# Altium project ALT0033 - Carnaval kleding REV E.PrjPcb
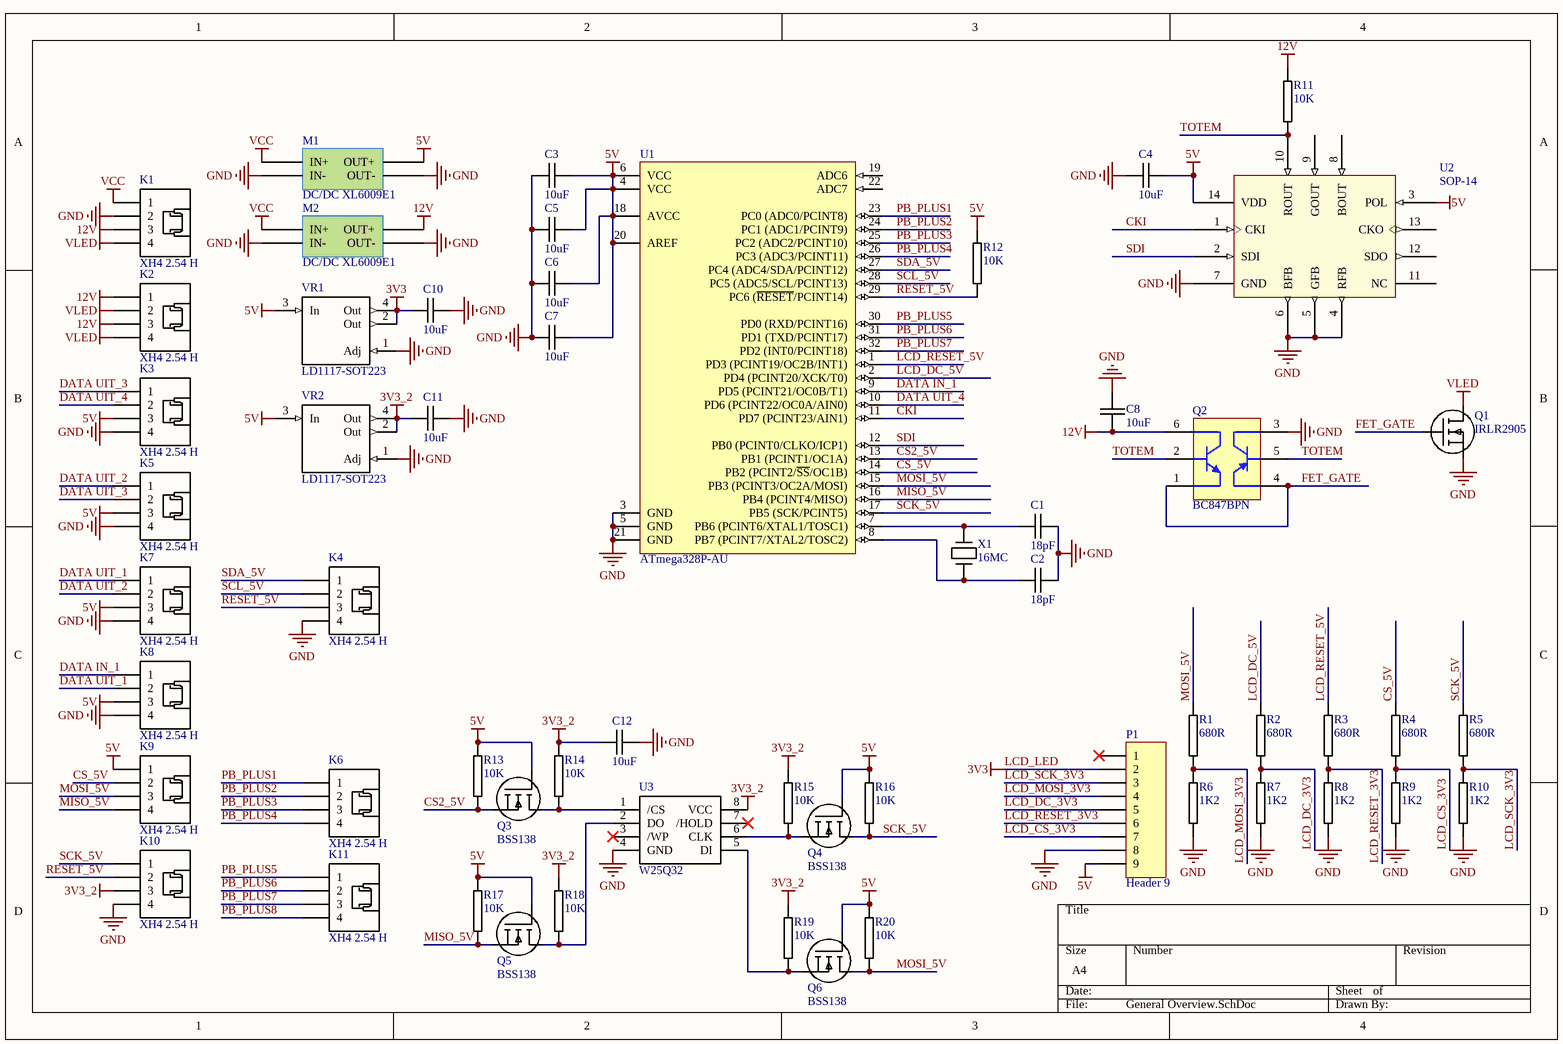
[diagram p0: General Overview.SchDoc]
1 sheet, 57 parts. Net scope: global (net labels, ports and power ports of the same name join across sheets).
Board file: A0033 - Carnaval kleding REV E - PCB.PcbDoc

## Sheet General Overview.SchDoc
size A4; PageSetup: Record=PageOptions|CenterHorizontal=True|CenterVertical=True|PrintScale=1.00|XCorrection=1.00|YCorrection=1.00|PrintKind=0|BorderSize=5000000|LeftOffset=0|BottomOffset=0|Orientation=2|PaperLength=1000|PaperWidth=1000|Scale=100|PaperSource=7|PrintQuality=-4|MediaType=1|DitherType=10|PaperKind=A4|PrintScaleMode=0

### Parts
C1  18pF  [0603C-GENERIC]
C2  18pF  [0603C-GENERIC]
C3  10uF  [0805C-GENERIC]
C4  10uF  [0805C-GENERIC]
C5  10uF  [0805C-GENERIC]
C6  10uF  [0805C-GENERIC]
C7  10uF  [0805C-GENERIC]
C8  10uF  [0805C-GENERIC]
C10  10uF  [0805C-GENERIC]
C11  10uF  [0805C-GENERIC]
C12  10uF  [0805C-GENERIC]
K1  XH4 2.54 H  [XH4 2.54 H]
K2  XH4 2.54 H  [XH4 2.54 H]
K3  XH4 2.54 H  [XH4 2.54 H]
K4  XH4 2.54 H  [XH4 2.54 H]
K5  XH4 2.54 H  [XH4 2.54 H]
K6  XH4 2.54 H  [XH4 2.54 H]
K7  XH4 2.54 H  [XH4 2.54 H]
K8  XH4 2.54 H  [XH4 2.54 H]
K9  XH4 2.54 H  [XH4 2.54 H]
K10  XH4 2.54 H  [XH4 2.54 H]
K11  XH4 2.54 H  [XH4 2.54 H]
M1  DC/DC XL6009E1  [DCDC XL6009E1]
M2  DC/DC XL6009E1  [DCDC XL6009E1]
P1  Header 9  [HDR1X9]
Q1  IRLR2905  [TO252AA-GDS]
Q2  BC847BPN  [SOT363_N]
Q3  BSS138  [SOT23-GDS]
Q4  BSS138  [SOT23-GDS]
Q5  BSS138  [SOT23-GDS]
Q6  BSS138  [SOT23-GDS]
R1  680R  [0805R-680]
R2  680R  [0805R-680]
R3  680R  [0805R-680]
R4  680R  [0805R-680]
R5  680R  [0805R-680]
R6  1K2  [0805R-1K2]
R7  1K2  [0805R-1K2]
R8  1K2  [0805R-1K2]
R9  1K2  [0805R-1K2]
R10  1K2  [0805R-1K2]
R11  10K  [0805R-10K]
R12  10K  [0805R-10K]
R13  10K  [0805R-10K]
R14  10K  [0805R-10K]
R15  10K  [0805R-10K]
R16  10K  [0805R-10K]
R17  10K  [0805R-10K]
R18  10K  [0805R-10K]
R19  10K  [0805R-10K]
R20  10K  [0805R-10K]
U1  ATmega328P-AU  [32A_N]
U2  SOP-14  [SO14]
U3  W25Q32  [SO8]
VR1  LD1117-SOT223  [SOT223]
VR2  LD1117-SOT223  [SOT223]
X1  16MC  [HC49_US TH]

### Nets
3V3_2: C11.2 C12.2 K10.3 R14.1 R15.1 R18.1 R19.1 U3.8(VCC) VR2.2(Out) VR2.4(Out)
5V: C3.1 C4.1 C5.2 C6.2 C7.2 K3.3 K5.3 K7.3 K8.3 K9.1 M1.OUT+ P1.9 Q3.G Q4.G Q5.G Q6.G R12.1 R13.1 R16.1 R17.1 R20.1 U1.4(VCC) U1.6(VCC) U1.18(AVCC) U1.20(AREF) U2.3(POL) U2.14(VDD) VR1.3(In) VR2.3(In)
12V: C8.2 K1.3 K2.1 K2.3 M2.OUT+ Q2.6(C1) R11.1
GND: C1.2 C2.2 C3.2 C4.2 C5.1 C6.1 C7.1 C8.1 C10.1 C11.1 C12.1 K1.2 K3.4 K4.4 K5.4 K7.4 K8.4 K10.4 M1.IN- M1.OUT- M2.IN- M2.OUT- P1.8 Q1.S Q2.3(C2) R6.2 R7.2 R8.2 R9.2 R10.2 U1.3(GND) U1.5(GND) U1.21(GND) U2.4(RFB) U2.5(GFB) U2.6(BFB) U2.7(GND) U3.4(GND) VR1.1(Adj) VR2.1(Adj)
LCD_LED: C10.2 P1.2 VR1.2(Out) VR1.4(Out)  [also labelled 3V3]
VCC: K1.1 M1.IN+ M2.IN+
VLED: K1.4 K2.2 K2.4 Q1.D
CKI: U1.11(PD7_(PCINT23/AIN1)) U2.1(CKI)
CS2_5V: Q3.S R13.2 U1.13(PB1_(PCINT1/OC1A))
CS_5V: K9.2 R4.1 U1.14(PB2_(PCINT2/~{SS}/OC1B))
DATA IN_1: K8.1 U1.9(PD5_(PCINT21/OC0B/T1))
DATA UIT_1: K7.1 K8.2
DATA UIT_2: K5.1 K7.2
DATA UIT_3: K3.1 K5.2
DATA UIT_4: K3.2 U1.10(PD6_(PCINT22/OC0A/AIN0))
FET_GATE: Q1.G Q2.1(E1) Q2.4(E2)
LCD_CS_3V3: P1.7 R4.2 R9.1
LCD_DC_3V3: P1.5 R2.2 R7.1
LCD_DC_5V: R2.1 U1.2(PD4_(PCINT20/XCK/T0))
LCD_MOSI_3V3: P1.4 R1.2 R6.1
LCD_RESET_3V3: P1.6 R3.2 R8.1
LCD_RESET_5V: R3.1 U1.1(PD3_(PCINT19/OC2B/INT1))
LCD_SCK_3V3: P1.3 R5.2 R10.1
MISO_5V: K9.4 Q5.S R17.2 U1.16(PB4_(PCINT4/MISO))
MOSI_5V: K9.3 Q6.D R1.1 R20.2 U1.15(PB3_(PCINT3/OC2A/MOSI))
PB_PLUS1: K6.1 U1.23(PC0_(ADC0/PCINT8))
PB_PLUS2: K6.2 U1.24(PC1_(ADC1/PCINT9))
PB_PLUS3: K6.3 U1.25(PC2_(ADC2/PCINT10))
PB_PLUS4: K6.4 U1.26(PC3_(ADC3/PCINT11))
PB_PLUS5: K11.1 U1.30(PD0_(RXD/PCINT16))
PB_PLUS6: K11.2 U1.31(PD1_(TXD/PCINT17))
PB_PLUS7: K11.3 U1.32(PD2_(INT0/PCINT18))
PB_PLUS8: K11.4
RESET_5V: K4.3 K10.2 R12.2 U1.29(PC6_(~{RESET}/PCINT14))
SCK_5V: K10.1 Q4.D R5.1 R16.2 U1.17(PB5_(SCK/PCINT5))
SCL_5V: K4.2 U1.28(PC5_(ADC5/SCL/PCINT13))
SDA_5V: K4.1 U1.27(PC4_(ADC4/SDA/PCINT12))
SDI: U1.12(PB0_(PCINT0/CLKO/ICP1)) U2.2(SDI)
TOTEM: Q2.2(B1) Q2.5(B2) R11.2 U2.10(ROUT)
NetC1_1: C1.1 U1.7(PB6_(PCINT6/XTAL1/TOSC1)) X1.1
NetC2_1: C2.1 U1.8(PB7_(PCINT7/XTAL2/TOSC2)) X1.2
NetQ3_D: Q3.D R14.2 U3.1(/CS)
NetQ4_S: Q4.S R15.2 U3.6(CLK)
NetQ5_D: Q5.D R18.2 U3.2(DO)
NetQ6_S: Q6.S R19.2 U3.5(DI)

Not connected (* = marked no-connect by the designer): P1 1*; U1 19(ADC6) 22(ADC7); U2 8(BOUT) 9(GOUT) 11(NC) 12(SDO) 13(CKO); U3 3(/WP)* 7(/HOLD)*

### Library data of the parts
C1 C2 = 0603C-15PF-50V-C0G-MUR: CAPACITOR 0603 CERAMIC; Reel: C2
C3-C8 C10-C12 = 0805C-10UF-25V-X5R-SAM: CAPACITOR 0805 CERAMIC; Manufacturer 1: Samsung; Manufacturer Part Number 1: CL21A106KACLRNC; Reel: C19; Supplier Part Number 1: CL21A106KACLRNC; Supplierr 1: Samsung
K1-K11 = XH4 2.54 H: 4 PIN XH 2.54
P1 = Header 9: Header, 9-Pin; LatestRevisionDate: 17-Jul-2002; LatestRevisionNote: Re-released for DXP Platform.; Publisher: Altium Limited
Q1 = IRLR2905: N CHANNEL MOSFET
Q2 = BC847BPN: NPN/PNP General-purpose Transistors; Published: 17-Sep-2003; LatestRevisionDate: 12-Dec-2006; LatestRevisionNote: IPC-7351 Footprint Added.; DatasheetVersion: 26-Oct-2001; PackageVersion: Feb-1997; PackageReference: SOT363; Publisher: Altium Limited; PackageDescription: 6-Pin SOT-363 Package 0.65 mm Pitch, 2.1 mm Lead Span; Code_JEITA: SC-88; Code_JEDEC: MO-203-AB; Code_IPC: SOT363-6; ComponentLink1Description: Manufacturer Link; ComponentLink1URL: http://www.semiconductors.philips.com/; ComponentLink2Description: Datasheet; ComponentLink2URL: http://www.semiconductors.philips.com/acrobat/datasheets/BC847BPN_3.pdf
Q3-Q6 = BSS138: N CHANNEL MOSFET; Manufacturer: Infineon Technologies; Manufacturer Part Number: BSS84P L6327; Reel: Q11; Input Capacitance (Ciss) @ Vds: 19pF @ 25V; Current - Continuous Drain (Id) @ 25° C: 170mA; Vgs(th) (Max) @ Id: 2V @ 20µA; FET Feature: Logic Level Gate; FET Type: MOSFET P-Channel, Metal Oxide; Power - Max: 360mW; Gate Charge (Qg) @ Vgs: 1.5nC @ 10V; Drain to Source Voltage (Vdss): 60V; Rds On (Max) @ Id, Vgs: 8 Ohm @ 170mA, 10V; Supplier 1: Digi-Key; Supplier: Digi-Key; Packaging: Tape & Reel (TR); RoHS: RoHS Compliant; Category: Discrete Semiconductor Products; Package / Case: SOT-23; Mounting Type: Surface Mount; Supplier Part Number 1: BSS84PL6327INTR-ND; Supplier Part Number: BSS84PL6327INTR-ND
R1-R5 = 0805R-680: RESISTOR 0805 1/4 WATT THIN FILM; Reel: *
R6-R10 = 0805R-1K2: RESISTOR 0805 1/4 WATT THIN FILM; Reel: *
R11-R20 = 0805R-10K: RESISTOR 0805 1/4 WATT THIN FILM; Reel: *
U1 = ATmega328P-AU: 8-bit AVR Microcontroller, 32KB Flash, 1KB EEPROM, 2KB SRAM, 32-pin TQFP, Industrial Grade (-40°C to 85°C); Published: 1-Apr-2010; DatasheetVersion: revA, Jan-2010; PackageVersion: revB, Oct-2001; PackageReference: 32A; Publisher: Altium Limited; PackageDescription: 32-Lead, 7x7x1.0 mm Body, 0.8mm Lead Pitch, Thin Profile Plastic Quad Flat Package (TQFP); Supplier 1: Digi-Key; Supplier Part Number 1: ATMEGA328P-AU-ND; Supplier 2: Farnell; Supplier Part Number 2: 1715486; Supplier 3: Mouser; Supplier Part Number 3: 556-ATMEGA328P-AU; Code_JEDEC: MS-026-ABA; ComponentLink1Description: Manufacturer Link; ComponentLink1URL: http://www.atmel.com/products/avr/default.asp?; ComponentLink2Description: ATmega48A/48PA/88A/88PA/168A/168PA/328/328P Datasheet; ComponentLink2URL: http://www.atmel.com/dyn/resources/prod_documents/8271.pdf; ComponentLink3Description: ATmega48A/48PA/88A/88PA/168A/168PA/328/328P Summary; ComponentLink3URL: http://www.atmel.com/dyn/resources/prod_documents/8271S.pdf; ComponentLink4Description: Atmel.com Home; ComponentLink4URL: http://www.atmel.com
U2 = WS2801
X1 = 16MC-HC49US TH: 16MHZ CRSYTAL HC49US
U3 = W25Q32: Supplier 1: Mouser; Supplier Part Number 1: 579-93C46B/SN